# Altium schematic sheet Daughterboard_Power.SchDoc: Interact Lab Daughterboard
size A4; DrawnBy: Ben Kazemi; Revision: 1; SheetNumber: 2; SheetTotal: 2; number: Power
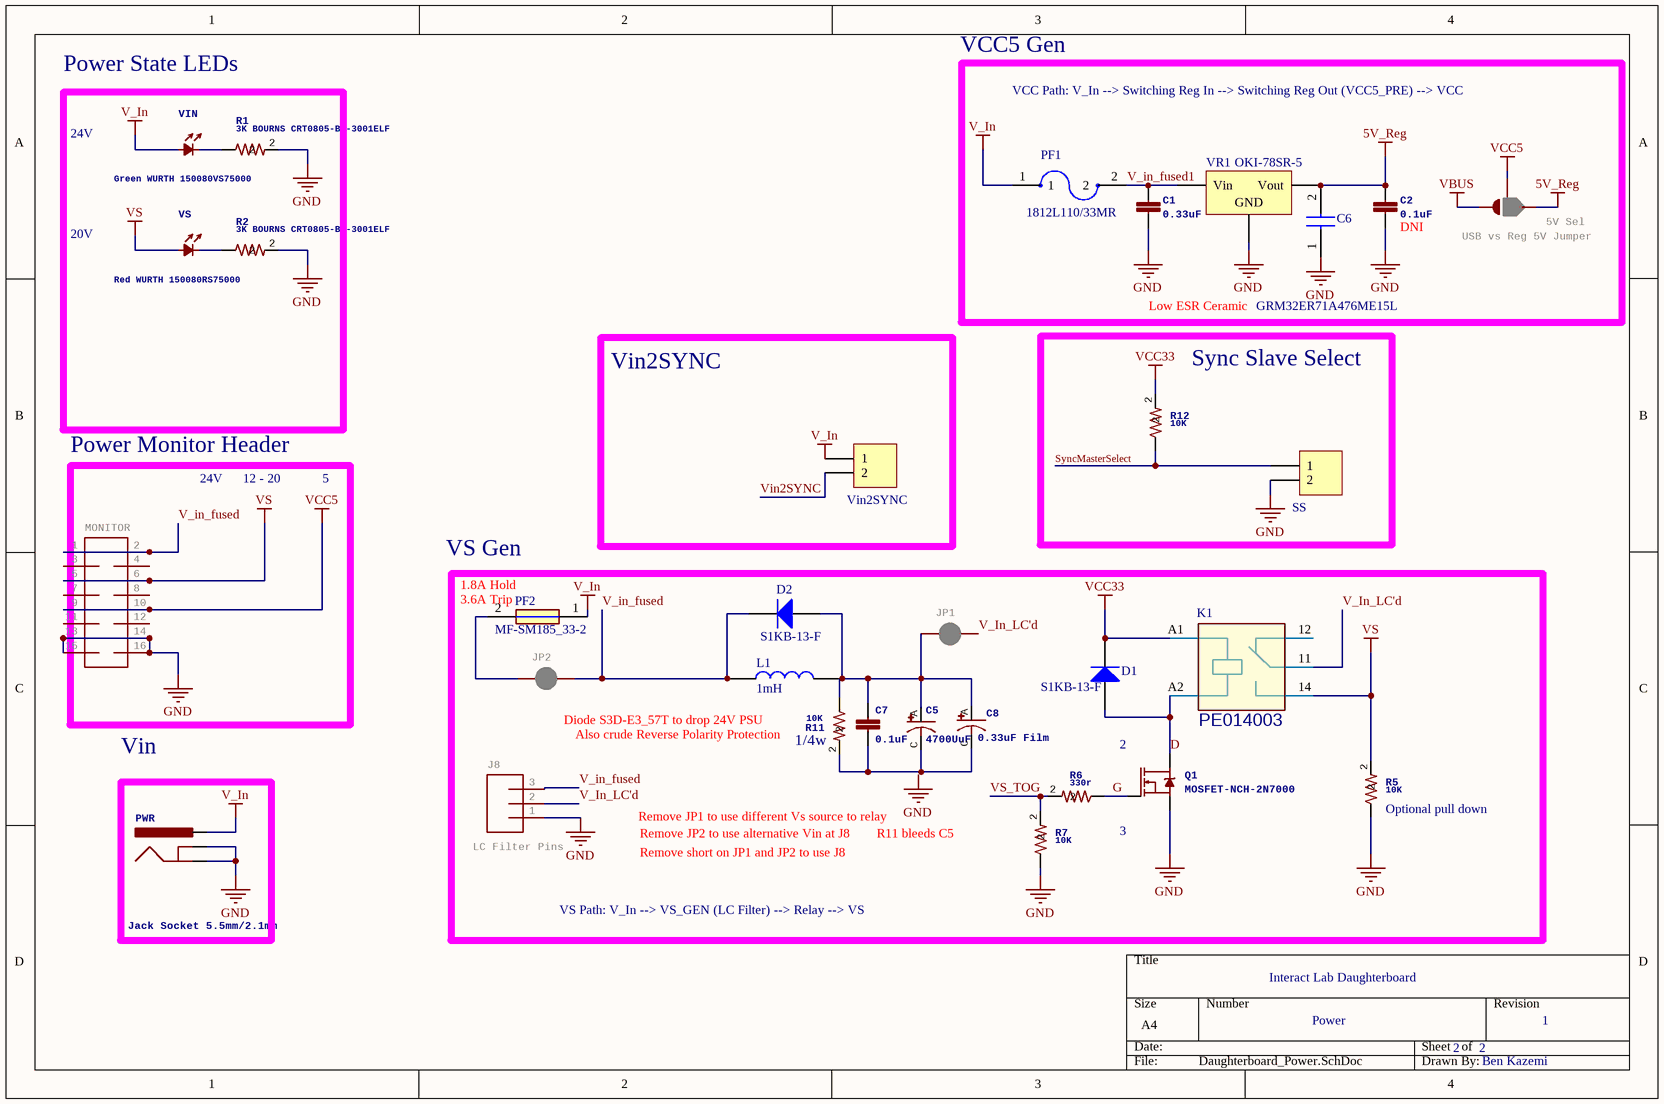
[diagram p0: Daughterboard_Power.SchDoc]

## Parts
5V_Sel  USB vs Reg 5V Jumper  [SMT-JUMPER_3_1-NC_PASTE_SILK]
C1  0.33uF  [CAP0805]
C2  0.1uF  [CAP0805]
C5  4700UuF  [CAP-PTH-10MM PITCH 22M]
C6  GRM32ER71A476ME15L  [CAPC3225X270N]
C7  0.1uF  [CAP0805]
C8  0.33uF Film  [R82DC3330AA60K Film Cap]
D1  S1KB-13-F  [SMB-DIODE]
D2  S1KB-13-F  [SMB-DIODE]
J8  LC Filter Pins  [1X03]
JP1  (no value)  [SMT-JUMPER_2_NC_PASTE_SILK]
JP2  (no value)  [SMT-JUMPER_2_NC_PASTE_SILK]
K1  PE014003  [SPDT Power Relay]
L1  1mH  [INDUCTOR Hor 2324VRC]
MONITOR  Multi connection point. Often used as Generic Header-pin footprint for 0.1 inch spaced/style header connections    You can populate with any combo of single row headers, but if you'd like an exact match, check this:  Header - 2x8 (Male, 0.1") (PRT-13156)       On any of the 0.1 inch spaced packages, you can populate with these:  Break Away Headers - Straight (PRT-00116)   Break Away Male Headers - Right Angle (PRT-00553)   Female Headers (PRT-00115)   Break Away Headers - Machine Pin (PRT-00117)   Break Away Female Headers - Swiss Machine Pin (PRT-00743)  [2X8_NOSILK]  (value not drawn)
PF1  1812L110/33MR  [Polyfuse]
PF2  MF-SM185_33-2  [FUSM8867X300N]
PWR  Jack Socket 5.5mm/2.1mm  [POWER_JACK_PTH_LOCK]
Q1  MOSFET-NCH-2N7000  [TO-92]
R1  3K BOURNS CRT0805-BY-3001ELF  [RES-0805]
R2  3K BOURNS CRT0805-BY-3001ELF  [RES-0805]
R5  10K  [RES-0805]
R6  330r  [RES-0805]
R7  10K  [RES-0805]
R11  10K  [RES-0805]
R12  10K  [RES-0805]
SS  (no value)  [HDR1X2]
VIN  Green WURTH 150080VS75000  [LED-0805 - GREEN]
Vin2SYNC  (no value)  [HDR1X2]
VR1  OKI-78SR-5  [OOKA-78SR]
VS  Red WURTH 150080RS75000  [LED-0805 - RED]

## Blocks framed on the sheet
Power State LEDs: R1 R2 VIN VS
VCC5 Gen: 5V_Sel C1 C2 C6 PF1 VR1
Vin2SYNC: Vin2SYNC
Sync Slave Select: R12 SS
Power Monitor Header: MONITOR
1/4w: C5 C7 C8 D1 D2 J8 JP1 JP2 K1 L1 PF2 Q1 R5-R7 R11

## Nets
5V_Reg: 5V_Sel.3 C2.1 C6.2 VR1.OUT(Vout)
GND: C1.2 C2.2 C6.1 J8.1 MONITOR.13 MONITOR.14 MONITOR.15 MONITOR.16 PWR.GND PWR.GNDBREAK Q1.1(S) R1.2 R2.2 R5.1 R7.1 SS.2 VR1.GND
V_In: PF1.1 PF2.1 PWR.PWR VIN.+ Vin2SYNC.1
VBUS: 5V_Sel.1
VCC5: 5V_Sel.2 MONITOR.9 MONITOR.10
VCC33: D1.C K1.A1 R12.2
VS: K1.14 MONITOR.5 MONITOR.6 R5.2 VS.+
D: D1.A K1.A2 Q1.3(D)
G: Q1.2(G) R6.1
SyncMasterSelect: R12.1 SS.1
V_in_fused: D2.C J8.3 JP2.2 L1.1 MONITOR.1 MONITOR.2
V_in_fused1: C1.1 PF1.2 VR1.IN(Vin)
V_In_LC'd: J8.2 JP1.2 K1.11
Vin2SYNC: Vin2SYNC.2
VS_TOG: R6.2 R7.2
NetC5_A: C5.A C7.1 C8.A D2.A JP1.1 L1.2 R11.1
NetC5_C: C5.C C7.2 C8.C R11.2
NetJP2_1: JP2.1 PF2.2
NetR1_1: R1.1 VIN.-
NetR2_1: R2.1 VS.-

Not connected (* = marked no-connect by the designer): K1 12; MONITOR 3 4 7 8 11 12

## Notes on the sheet
- VCC Path: V_In --> Switching Reg In --> Switching Reg Out (VCC5_PRE) --> VCC
- 24V
- 20V
- (near C2) DNI
- Low ESR Ceramic
- 12 - 20
- 5
- (near PF2) VS Gen
- (near PF2) 1.8A Hold
- (near PF2) 3.6A Trip
- Vin
- Diode S3D-E3_57T to drop 24V PSU
- (near R11) Also crude Reverse Polarity Protection
- (near Q1) 2
- Remove JP1 to use different Vs source to relay
- Remove JP2 to use alternative Vin at J8
- R11 bleeds C5
- 3
- (near R5) Optional pull down
- Remove short on JP1 and JP2 to use J8
- VS Path: V_In --> VS_GEN (LC Filter) --> Relay --> VS
- Labels drawn without touching a wire or pin: GND

## Library data of the parts
5V_Sel = JUMPER-SMT_3_1-NC_PASTE_SILK: GateName_1: G$1; SymbolName_1: SMT-JUMPER_3_1-NC_PASTE; DeviceName: _SILK; LibraryName: SparkFun-Jumpers; DeviceSetName: JUMPER-SMT_3_1-NC_PASTE; Package: SMT-JUMPER_3_1-NC_PASTE_SILK
C1 C2 C7 = CAP CERAMIC: PROD_ID: CAP-08280
C5 C8 = CAP ELECTRO: PROD_ID: CAP-09538
C6 = GRM32ER71A476ME15L: Capacitor; Manufacturer_Name: Murata Electronics; Datasheet Link: https://psearch.en.murata.com/capacitor/product/GRM32ER71A476ME15%23.html; Height: 2.7mm; Manufacturer_Part_Number: GRM32ER71A476ME15L; Mouser Part Number: 81-GRM32ER71A476ME5L; Mouser Price/Stock: https://www.mouser.co.uk/ProductDetail/Murata-Electronics/GRM32ER71A476ME15L?qs=xcCo%252BfWZmQV8JP9RObVeqA%3D%3D; Arrow Part Number: GRM32ER71A476ME15L; Arrow Price/Stock: https://www.arrow.com/en/products/grm32er71a476me15l/murata-manufacturing
D1 D2 = Diode SMB: 1 Amp General Purpose Rectifier; Published: 8-Jun-2000; LatestRevisionDate: 17-Jul-2002; LatestRevisionNote: Re-released for DXP Platform.; PackageReference: DO-41; Publisher: Altium Limited; PackageDescription: Diode, Axial; Body 5.2 x 2.7 mm (LxDia. max), Lead Dia. 0.86 mm (max); Code_JEDEC: DO-204-AL; DatasheetVersion: 1998; PackageVersion: Aug-1999; ComponentLink1Description: Manufacturer Link; ComponentLink1URL: http://www.fairchildsemi.com/; ComponentLink2Description: Datasheet; ComponentLink2URL: http://www.fairchildsemi.com/ds/1N%2F1N4001.pdf
J8 = CONN_03: GateName_1: J$1; PROD_ID: XXX-00000; SymbolName_1: CONN_03; LibraryName: SparkFun-Connectors; DeviceSetName: CONN_03; Package: 1X03
JP1 JP2 = JUMPER-SMT_2_NC_PASTE_SILK: GateName_1: G$1; SymbolName_1: SMT-JUMPER_2_NC_PASTE; DeviceName: _SILK; LibraryName: SparkFun-Jumpers; DeviceSetName: JUMPER-SMT_2_NC_PASTE; Package: SMT-JUMPER_2_NC_PASTE_SILK
K1 = Power Relay SPDT: MP: 1-1393219-0; Contact_Current_Rating_Max: 5 A; MF: TE Connectivity; Contact_Switching_Voltage_Max: 400 VAC; SnapEDA_Link: https://www.snapeda.com/parts/1-1393219-0/TE%20Connectivity/view-part/?ref=snap; Package: None; Availability: Unavailable; Price: None; TE_purchase_URL: https://www.te.com/usa-en/product-1-1393219-0.html?te_bu=Cor&te_type=disp&te_campaign=seda_glo_cor-seda-global-disp-prtnr-fy19-seda-model-bom-cta_sma-317_1&elqCampaignId=32493; Value: *
L1 = INDUCTOR 2324-V-RC: Bourns 1 mH +/-15% Leaded Inductor, 2.4A Idc, 300m Rdc 2300; Allied_Number: 70408237; Geometry.Height: 32mm; RS Part Number: 1729913; Manufacturer_Name: Bourns; Manufacturer_Part_Number: 2324-V-RC; Datasheet Link: http://uk.rs-online.com/web/p/products/1729913
MONITOR = CONN_08X2_NOSILK: GateName_1: J1; SymbolName_1: CONN_2X8; DeviceName: _NOSILK; LibraryName: SparkFun-Connectors; DeviceSetName: CONN_08X2; Package: 2X8_NOSILK
PF1 = 1812L110/33MR: PTC Resettable Fuse 1.1A_hold_ 1.95A_trip_ 33VDC 20A 0.8W 0.5s 0.06Ohm SMD Solder Pad 1812 T/R; MF: Littelfuse Inc.; Availability: Unavailable; Package: 1812 Littelfuse; Price: None; SnapEDA_Link: https://www.snapeda.com/parts/1812L110/33MR/Littelfuse%20Inc./view-part/?ref=snap; MP: 1812L110/33MR; Value: *
PF2 = MF-SM185_33-2: Fuse; Manufacturer_Name: Bourns; Manufacturer_Part_Number: MF-SM185/33-2; Datasheet Link: https://www.mouser.com/datasheet/2/54/bourns_mfsm-1159445.pdf; Height: 3mm; Mouser Part Number: 652-MF-SM185/33-2; Mouser Price/Stock: https://www.mouser.co.uk/ProductDetail/Bourns/MF-SM185-33-2?qs=lgDiYRnMSkaEGAwXdMV4ng%3D%3D; Arrow Part Number: MF-SM185/33-2; Arrow Price/Stock: https://www.arrow.com/en/products/mf-sm18533-2/bourns
PWR = POWER_JACKPTH_LOCK: PROD_ID: CONN-08197; SF_ID: PRT-00119
R1 R2 R5-R7 R11 R12 = RESISTOR: MPN: CRCW0603470RFKEA; MF: Vishay; OC_MOUSER: 71-CRCW0603-470-E3; PACKAGE: 0603; TYPE: Resistor
SS Vin2SYNC = Header 2: Header, 2-Pin; LatestRevisionDate: 17-Jul-2002; LatestRevisionNote: Re-released for DXP Platform.; Publisher: Altium Limited
VIN VS = LED: PACKAGE: 0805
  VIN: Datasheet: https://docs-emea.rs-online.com/webdocs/1302/0900766b81302e25.pdf
  VS: Datasheet: https://docs-emea.rs-online.com/webdocs/1302/0900766b81302e21.pdf
VR1 = Volt Reg: Voltage Regulator; Published: 24-Mar-1999; LatestRevisionDate: 29-May-2009; LatestRevisionNote: IPC-7351 Footprint Added.; PackageReference: D2PAK; Publisher: Altium Limited; PackageDescription: 3-Pin Transistor Outline Package 2.54 mm Pitch, 15.1 mm Lead Span; Datasheet: http://www.farnell.com/datasheets/1904473.pdf?_ga=2.85272922.296638663.1549285494-96194751.1546862067